# Altium project RK3128_BETA_V03_20151231.PrjPcb (part 3 of 3)
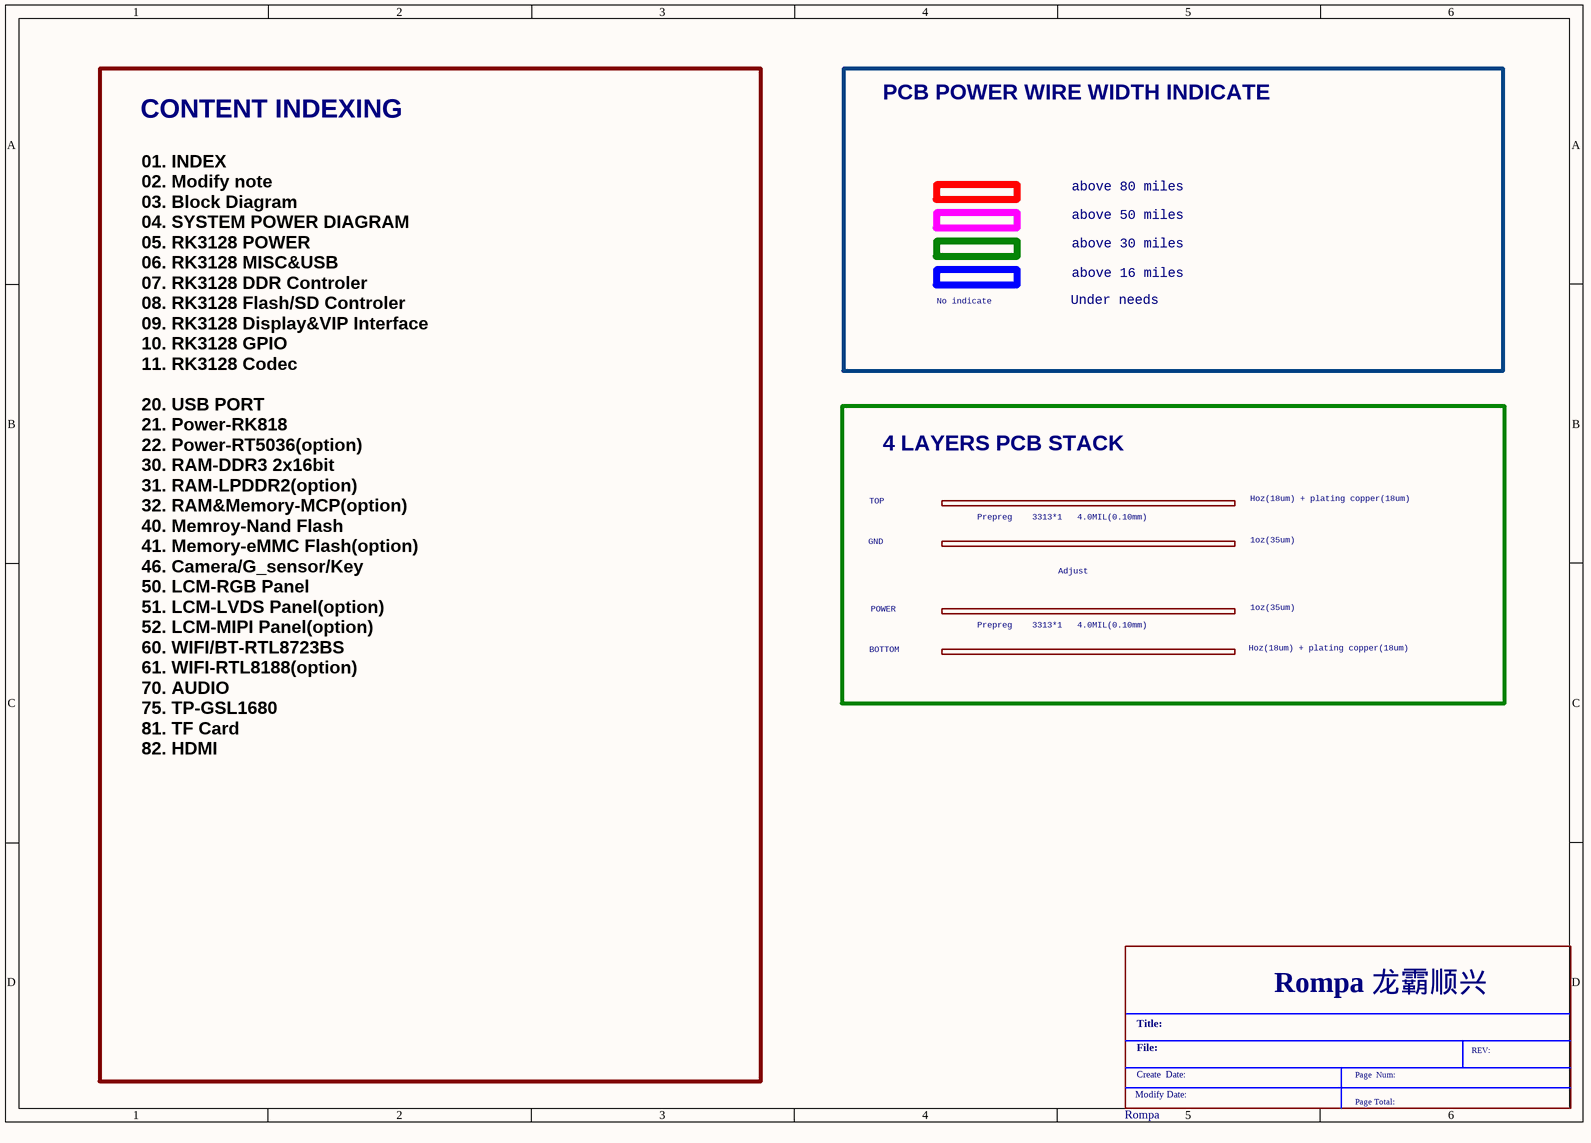
[diagram p28: 01_index.SchDoc]

## Nets that join several sheets
GND: Option_DDR3_96ball (76 pins), Option_Nand_Flash (13 pins), Option_LPDDR2-32_168_BGA134 (57 pins), Option_lcd (18 pins), Option_PMIC_RK816 (C227.2 C228.2), Option_CTP (6 pins), Option_camera (14 pins), Option_Audio (12 pins), Option_key (9 pins), Option_AP6xxx (30 pins), Option_PMIC_RK808 (65 pins), Option_Charger (25 pins), Option_LighterSensor (C149.2 C150.2 R95.1 U12.2), Option_Humidity_Tempture_Sensor (6 pins), Option_MotionSensor (11 pins), Option_PMIC_RK818 (55 pins), 11_RK3128_CODEC_HDMI_DAC (15 pins), 09_Rk3128_lcd_cif (C42.2 C43.2 C44.2 R4.2), 08_RK3128_Flash_SDMMC (P1.3), 07_RK3128_DDR (12 pins), 06_RK3128_USB_ADC_Crystal (14 pins), 05_RK3128_VDD (74 pins)
MICBIAS: Option_Audio (R37.1), 11_RK3128_CODEC_HDMI_DAC (C45.1 U1.B18)
VCC18_CIF: Option_camera (C85.1 C86.1 P3.10), Option_PMIC_RK808 (C196.1 U18.5), Option_PMIC_RK818 (C251.1 U19.51)
VCC28_CIF: Option_camera (6 pins), Option_PMIC_RK808 (C202.2 U18.14), Option_PMIC_RK818 (C249.1 U19.48)
VCC33_HDMI: Option_PMIC_RK818 (C247.1 U19.46), 11_RK3128_CODEC_HDMI_DAC (C48.1 C49.1 U1.V2)
VCC50_HDMI: Option_PMIC_RK818 (C261.1 U19.3), 11_RK3128_CODEC_HDMI_DAC (C52.2)
VCC_DDR: Option_DDR3_96ball (62 pins), Option_LPDDR2-32_168_BGA134 (40 pins), Option_PMIC_RK808 (C210.1 L12.2 R107.1), Option_PMIC_RK818 (C238.1 C239.1 L17.2 R131.1), 07_RK3128_DDR (20 pins)
VCC_IO: Option_Nand_Flash (16 pins), Option_LPDDR2-32_168_BGA134 (C170.1 R101.1 U14.1), Option_lcd (R83.1), Option_PMIC_RK816 (C226.1 L14.1 R126.1), Option_key (R78.1 R81.2 R82.2), Option_AP6xxx (L4.1 R25.2), Option_PMIC_RK808 (23 pins), Option_LighterSensor (C149.1 C150.1 U12.1), Option_Humidity_Tempture_Sensor (C142.1 R75.2 R77.2 U10.5), Option_MotionSensor (9 pins), Option_PMIC_RK818 (15 pins), 10_RK3128_misc (R13.1 R14.1), 09_Rk3128_lcd_cif (C43.1 R5.2), 06_RK3128_USB_ADC_Crystal (6 pins), 05_RK3128_VDD (8 pins)
VCC_LCD: Option_lcd (P8.4 R90.1 R91.1 R93.1), Option_PMIC_RK816 (C227.1 C228.1), Option_PMIC_RK808 (C211.2 U18.11), Option_PMIC_RK818 (C254.1 C259.1 C260.1 U19.54)
VCC_SD: Option_PMIC_RK808 (C198.2 U18.7), Option_PMIC_RK818 (C253.1 U19.52)
VCC_SYS: Option_lcd (C146.1 L9.1 U11.6), Option_Audio (C76.1 L5.1), Option_AP6xxx (L3.1), Option_PMIC_RK808 (23 pins), Option_PMIC_RK818 (20 pins)
VCC_TP: Option_CTP (C108.1 C109.1 U7.1 U7.7), Option_PMIC_RK808 (C190.2 U18.31), Option_PMIC_RK818 (C241.1 U19.14)
VCCA_CODEC: Option_PMIC_RK808 (C191.2 U18.33), Option_PMIC_RK818 (C243.1 U19.16), 11_RK3128_CODEC_HDMI_DAC (5 pins)
VDD11_HDMI: Option_PMIC_RK818 (C250.1 U19.49), 11_RK3128_CODEC_HDMI_DAC (C50.1 C51.1 U1.V4)
VDD_1.8: Option_PMIC_RK818 (C246.1 U19.44), 09_Rk3128_lcd_cif (R6.2)
VDD_11: Option_PMIC_RK808 (C194.2 U18.3), Option_PMIC_RK818 (C244.1 U19.47), 09_Rk3128_lcd_cif (C42.1 U1.R8), 06_RK3128_USB_ADC_Crystal (5 pins)
VDD_ARM: Option_PMIC_RK808 (C195.1 L10.2 U18.39), Option_PMIC_RK818 (6 pins), 05_RK3128_VDD (13 pins)
VDD_LOG: Option_PMIC_RK808 (C203.1 L11.2 U18.29), Option_PMIC_RK818 (6 pins), 05_RK3128_VDD (14 pins)
VREF_DDR: Option_DDR3_96ball (12 pins), Option_LPDDR2-32_168_BGA134 (8 pins)
ADCIN0: Option_Humidity_Tempture_Sensor (C143.1 R76.1 R77.1), 06_RK3128_USB_ADC_Crystal (U1.P11)
ADCIN1: Option_key (C144.1 R78.2 R79.1), 06_RK3128_USB_ADC_Crystal (U1.U10)
ADCIN2: Option_Humidity_Tempture_Sensor (C141.1 P7.1 R75.1), 06_RK3128_USB_ADC_Crystal (U1.V10)
BT_PCM_CLK: Option_AP6xxx (U2.26), 10_RK3128_misc (U1.K20)
BT_PCM_IN: Option_AP6xxx (U2.27), 10_RK3128_misc (U1.L20)
BT_PCM_OUT: Option_AP6xxx (U2.25), 10_RK3128_misc (U1.K19)
BT_PCM_SYNC: Option_AP6xxx (U2.28), 10_RK3128_misc (U1.J19)
Camera_I2C_SCL: Option_CTP (U7.11 U7.12), Option_camera (P3.3 P3.5), Option_LighterSensor (U12.5 U12.6), Option_Humidity_Tempture_Sensor (U10.1 U10.6), Option_MotionSensor (U15.6 U15.7 U16.2 U16.12), 10_RK3128_misc (R13.2 R14.2), 09_Rk3128_lcd_cif (U1.P3 U1.T4)
CIF_CLKI: Option_camera (R50.1), 09_Rk3128_lcd_cif (U1.U16)
CIF_CLKO: Option_camera (C88.1 R51.1), 09_Rk3128_lcd_cif (U1.V13)
CIF_D0: Option_camera (P3.19), 09_Rk3128_lcd_cif (U1.U17)
CIF_D1: Option_camera (P3.21), 09_Rk3128_lcd_cif (U1.V17)
CIF_D2: Option_camera (P3.22), 09_Rk3128_lcd_cif (U1.W17)
CIF_D3: Option_camera (P3.20), 09_Rk3128_lcd_cif (U1.V16)
CIF_D4: Option_camera (P3.18), 09_Rk3128_lcd_cif (U1.T13)
CIF_D5: Option_camera (P3.16), 09_Rk3128_lcd_cif (U1.R13)
CIF_D6: Option_camera (P3.14), 09_Rk3128_lcd_cif (U1.R14)
CIF_D7: Option_camera (P3.12), 09_Rk3128_lcd_cif (U1.T16)
CIF_HREF: Option_camera (P3.9), 09_Rk3128_lcd_cif (U1.V18)
CIF_VSYNC: Option_camera (P3.7), 09_Rk3128_lcd_cif (U1.U13)
CODEC_AOL: Option_Audio (C81.1), 11_RK3128_CODEC_HDMI_DAC (U1.B17)
CODEC_AOR: Option_Audio (C80.1), 11_RK3128_CODEC_HDMI_DAC (U1.B15)
DDR_A0: Option_DDR3_96ball (U8.N3 U9.N3), Option_LPDDR2-32_168_BGA134 (U13.AC6), 07_RK3128_DDR (U1.D1)
DDR_A1: Option_DDR3_96ball (U8.P7 U9.P7), Option_LPDDR2-32_168_BGA134 (U13.AB6), 07_RK3128_DDR (U1.A4)
DDR_A2: Option_DDR3_96ball (U8.P3 U9.P3), Option_LPDDR2-32_168_BGA134 (U13.AC7), 07_RK3128_DDR (U1.E2)
DDR_A3: Option_DDR3_96ball (U8.N2 U9.N2), Option_LPDDR2-32_168_BGA134 (U13.AB8), 07_RK3128_DDR (U1.D2)
DDR_A4: Option_DDR3_96ball (U8.P8 U9.P8), Option_LPDDR2-32_168_BGA134 (U13.AB9), 07_RK3128_DDR (U1.A2)
DDR_A5: Option_DDR3_96ball (U8.P2 U9.P2), Option_LPDDR2-32_168_BGA134 (U13.W1), 07_RK3128_DDR (U1.E5)
DDR_A6: Option_DDR3_96ball (U8.R8 U9.R8), Option_LPDDR2-32_168_BGA134 (U13.V2), 07_RK3128_DDR (U1.F7)
DDR_A7: Option_DDR3_96ball (U8.R2 U9.R2), Option_LPDDR2-32_168_BGA134 (U13.U1), 07_RK3128_DDR (U1.E4)
DDR_A8: Option_DDR3_96ball (U8.T8 U9.T8), Option_LPDDR2-32_168_BGA134 (U13.T2), 07_RK3128_DDR (U1.D8)
DDR_A9: Option_DDR3_96ball (U8.R3 U9.R3), Option_LPDDR2-32_168_BGA134 (U13.T1), 07_RK3128_DDR (U1.E1)
DDR_A10: Option_DDR3_96ball (U8.L7 U9.L7), 07_RK3128_DDR (U1.C4)
DDR_A11: Option_DDR3_96ball (U8.R7 U9.R7), 07_RK3128_DDR (U1.C5)
DDR_A12: Option_DDR3_96ball (U8.N7 U9.N7), 07_RK3128_DDR (U1.B4)
DDR_A13: Option_DDR3_96ball (U8.T3 U9.T3), 07_RK3128_DDR (U1.G1)
DDR_A14: Option_DDR3_96ball (U8.T7 U9.T7), 07_RK3128_DDR (U1.B5)
DDR_A15: Option_DDR3_96ball (U8.M7 U9.M7), 07_RK3128_DDR (U1.A5)
DDR_BA0: Option_DDR3_96ball (U8.M2 U9.M2), 07_RK3128_DDR (U1.D7)
DDR_BA1: Option_DDR3_96ball (U8.N8 U9.N8), 07_RK3128_DDR (U1.E8)
DDR_BA2: Option_DDR3_96ball (U8.M3 U9.M3), 07_RK3128_DDR (U1.D3)
DDR_CASN: Option_DDR3_96ball (U8.K3 U9.K3), 07_RK3128_DDR (U1.E7)
DDR_CKE: Option_LPDDR2-32_168_BGA134 (U13.AC3 U13.AC4), 07_RK3128_DDR (U1.B3)
DDR_CLK: Option_DDR3_96ball (R72.1 U8.J7 U9.J7), Option_LPDDR2-32_168_BGA134 (R98.2 U13.Y2), 07_RK3128_DDR (U1.B1)
DDR_CLKN: Option_DDR3_96ball (R72.2 U8.K7 U9.K7), Option_LPDDR2-32_168_BGA134 (R98.1 U13.Y1), 07_RK3128_DDR (U1.C2)
DDR_CS0N: Option_DDR3_96ball (U8.L2 U9.L2), Option_LPDDR2-32_168_BGA134 (U13.AB3), 07_RK3128_DDR (U1.A1)
DDR_CS1N: Option_DDR3_96ball (U8.L1 U9.L1), Option_LPDDR2-32_168_BGA134 (U13.AB4), 07_RK3128_DDR (U1.B6)
DDR_D0: Option_DDR3_96ball (U9.F2), Option_LPDDR2-32_168_BGA134 (U13.AA23), 07_RK3128_DDR (U1.A14)
DDR_D1: Option_DDR3_96ball (U9.H8), Option_LPDDR2-32_168_BGA134 (U13.Y22), 07_RK3128_DDR (U1.F8)
DDR_D2: Option_DDR3_96ball (U9.H7), Option_LPDDR2-32_168_BGA134 (U13.W22), 07_RK3128_DDR (U1.F11)
DDR_D3: Option_DDR3_96ball (U9.F8), Option_LPDDR2-32_168_BGA134 (U13.W23), 07_RK3128_DDR (U1.A7)
DDR_D4: Option_DDR3_96ball (U9.F7), Option_LPDDR2-32_168_BGA134 (U13.V23), 07_RK3128_DDR (U1.B10)
DDR_D5: Option_DDR3_96ball (U9.H3), Option_LPDDR2-32_168_BGA134 (U13.U22), 07_RK3128_DDR (U1.D10)
DDR_D6: Option_DDR3_96ball (U9.E3), Option_LPDDR2-32_168_BGA134 (U13.T22), 07_RK3128_DDR (U1.B13)
DDR_D7: Option_DDR3_96ball (U9.G2), Option_LPDDR2-32_168_BGA134 (U13.T23), 07_RK3128_DDR (U1.C8)
DDR_D8: Option_DDR3_96ball (U8.H7), Option_LPDDR2-32_168_BGA134 (U13.H22), 07_RK3128_DDR (U1.G6)
DDR_D9: Option_DDR3_96ball (U8.F8), Option_LPDDR2-32_168_BGA134 (U13.H23), 07_RK3128_DDR (U1.G5)
DDR_D10: Option_DDR3_96ball (U8.H8), Option_LPDDR2-32_168_BGA134 (U13.G23), 07_RK3128_DDR (U1.F2)
DDR_D11: Option_DDR3_96ball (U8.E3), Option_LPDDR2-32_168_BGA134 (U13.F22), 07_RK3128_DDR (U1.H6)
DDR_D12: Option_DDR3_96ball (U8.H3), Option_LPDDR2-32_168_BGA134 (U13.E22), 07_RK3128_DDR (U1.H3)
DDR_D13: Option_DDR3_96ball (U8.F7), Option_LPDDR2-32_168_BGA134 (U13.E23), 07_RK3128_DDR (U1.J2)
DDR_D14: Option_DDR3_96ball (U8.G2), Option_LPDDR2-32_168_BGA134 (U13.D23), 07_RK3128_DDR (U1.K2)
DDR_D15: Option_DDR3_96ball (U8.F2), Option_LPDDR2-32_168_BGA134 (U13.C22), 07_RK3128_DDR (U1.K1)
DDR_D16: Option_DDR3_96ball (U9.D7), Option_LPDDR2-32_168_BGA134 (U13.AB12), 07_RK3128_DDR (U1.A10)
DDR_D17: Option_DDR3_96ball (U9.A7), Option_LPDDR2-32_168_BGA134 (U13.AC13), 07_RK3128_DDR (U1.C11)
DDR_D18: Option_DDR3_96ball (U9.B8), Option_LPDDR2-32_168_BGA134 (U13.AB14), 07_RK3128_DDR (U1.B9)
DDR_D19: Option_DDR3_96ball (U9.A2), Option_LPDDR2-32_168_BGA134 (U13.AC14), 07_RK3128_DDR (U1.E11)
DDR_D20: Option_DDR3_96ball (U9.C3), Option_LPDDR2-32_168_BGA134 (U13.AB15), 07_RK3128_DDR (U1.E10)
DDR_D21: Option_DDR3_96ball (U9.C8), Option_LPDDR2-32_168_BGA134 (U13.AC16), 07_RK3128_DDR (U1.B12)
DDR_D22: Option_DDR3_96ball (U9.C2), Option_LPDDR2-32_168_BGA134 (U13.AB17), 07_RK3128_DDR (U1.F10)
DDR_D23: Option_DDR3_96ball (U9.A3), Option_LPDDR2-32_168_BGA134 (U13.AC17), 07_RK3128_DDR (U1.A13)
DDR_D24: Option_DDR3_96ball (U8.D7), Option_LPDDR2-32_168_BGA134 (U13.B17), 07_RK3128_DDR (U1.K4)
DDR_D25: Option_DDR3_96ball (U8.C3), Option_LPDDR2-32_168_BGA134 (U13.A17), 07_RK3128_DDR (U1.L4)
DDR_D26: Option_DDR3_96ball (U8.C8), Option_LPDDR2-32_168_BGA134 (U13.A16), 07_RK3128_DDR (U1.G4)
DDR_D27: Option_DDR3_96ball (U8.A2), Option_LPDDR2-32_168_BGA134 (U13.B15), 07_RK3128_DDR (U1.K5)
DDR_D28: Option_DDR3_96ball (U8.A7), Option_LPDDR2-32_168_BGA134 (U13.B14), 07_RK3128_DDR (U1.H5)
DDR_D29: Option_DDR3_96ball (U8.A3), Option_LPDDR2-32_168_BGA134 (U13.A14), 07_RK3128_DDR (U1.K6)
DDR_D30: Option_DDR3_96ball (U8.B8), Option_LPDDR2-32_168_BGA134 (U13.A13), 07_RK3128_DDR (U1.L5)
DDR_D31: Option_DDR3_96ball (U8.C2), Option_LPDDR2-32_168_BGA134 (U13.B12), 07_RK3128_DDR (U1.L6)
DDR_DM0: Option_DDR3_96ball (U9.E7), Option_LPDDR2-32_168_BGA134 (U13.N23), 07_RK3128_DDR (U1.B7)
DDR_DM1: Option_DDR3_96ball (U8.E7), Option_LPDDR2-32_168_BGA134 (U13.L23), 07_RK3128_DDR (U1.H4)
DDR_DM2: Option_DDR3_96ball (U9.D3), Option_LPDDR2-32_168_BGA134 (U13.AB20), 07_RK3128_DDR (U1.D11)
DDR_DM3: Option_DDR3_96ball (U8.D3), Option_LPDDR2-32_168_BGA134 (U13.B20), 07_RK3128_DDR (U1.L3)
DDR_DQS0N: Option_DDR3_96ball (U9.G3), Option_LPDDR2-32_168_BGA134 (U13.P22), 07_RK3128_DDR (U1.B8)
DDR_DQS0P: Option_DDR3_96ball (U9.F3), Option_LPDDR2-32_168_BGA134 (U13.R23), 07_RK3128_DDR (U1.A8)
DDR_DQS1N: Option_DDR3_96ball (U8.G3), Option_LPDDR2-32_168_BGA134 (U13.K23), 07_RK3128_DDR (U1.H2)
DDR_DQS1P: Option_DDR3_96ball (U8.F3), Option_LPDDR2-32_168_BGA134 (U13.J22), 07_RK3128_DDR (U1.H1)
DDR_DQS2N: Option_DDR3_96ball (U9.B7), Option_LPDDR2-32_168_BGA134 (U13.AC19), 07_RK3128_DDR (U1.B11)
DDR_DQS2P: Option_DDR3_96ball (U9.C7), Option_LPDDR2-32_168_BGA134 (U13.AB18), 07_RK3128_DDR (U1.A11)
DDR_DQS3N: Option_DDR3_96ball (U8.B7), Option_LPDDR2-32_168_BGA134 (U13.A19), 07_RK3128_DDR (U1.L2)
DDR_DQS3P: Option_DDR3_96ball (U8.C7), Option_LPDDR2-32_168_BGA134 (U13.B18), 07_RK3128_DDR (U1.L1)
DDR_ODT0: Option_DDR3_96ball (U8.K1 U9.K1), 07_RK3128_DDR (U1.B2)
DDR_ODT1: Option_DDR3_96ball (U8.J1 U9.J1), 07_RK3128_DDR (U1.G2)
DDR_RASN: Option_DDR3_96ball (U8.J3 U9.J3), 07_RK3128_DDR (U1.E3)
DDR_RST: Option_DDR3_96ball (U8.T2 U9.T2), 07_RK3128_DDR (U1.F6)
DDR_WEN: Option_DDR3_96ball (U8.L3 U9.L3), 07_RK3128_DDR (U1.D5)
FLASH_ALE: Option_Nand_Flash (U17.17), 08_RK3128_Flash_SDMMC (U1.N16)
FLASH_CLE: Option_Nand_Flash (J1.1 U17.16), 08_RK3128_Flash_SDMMC (U1.N17)
FLASH_CS0: Option_Nand_Flash (U17.9), 08_RK3128_Flash_SDMMC (U1.L16)
FLASH_CS1: Option_Nand_Flash (U17.10), 08_RK3128_Flash_SDMMC (U1.L17)
FLASH_D0: Option_Nand_Flash (U17.29), 08_RK3128_Flash_SDMMC (U1.P16)
FLASH_D1: Option_Nand_Flash (U17.30), 08_RK3128_Flash_SDMMC (U1.U20)
FLASH_D2: Option_Nand_Flash (U17.31), 08_RK3128_Flash_SDMMC (U1.T19)
FLASH_D3: Option_Nand_Flash (U17.32), 08_RK3128_Flash_SDMMC (U1.T20)
FLASH_D4: Option_Nand_Flash (U17.41), 08_RK3128_Flash_SDMMC (U1.P18)
FLASH_D5: Option_Nand_Flash (U17.42), 08_RK3128_Flash_SDMMC (U1.R19)
FLASH_D6: Option_Nand_Flash (U17.43), 08_RK3128_Flash_SDMMC (U1.N15)
FLASH_D7: Option_Nand_Flash (U17.44), 08_RK3128_Flash_SDMMC (U1.P17)
FLASH_RDN: Option_Nand_Flash (U17.8), 08_RK3128_Flash_SDMMC (U1.L15)
FLASH_RDY: Option_Nand_Flash (5 pins), 08_RK3128_Flash_SDMMC (U1.K17)
FLASH_WRN: Option_Nand_Flash (U17.18), 08_RK3128_Flash_SDMMC (U1.P20)
GPIO0_B4/I2S_LRCK_TX: Option_PMIC_RK816 (R127.2), Option_PMIC_RK818 (R135.2), 10_RK3128_misc (U1.H16)
GPIO0_D3/BL_EN: Option_lcd (R85.1 U11.4), 10_RK3128_misc (U1.T17)
GPIO1_A7: Option_AP6xxx (R18.1), 08_RK3128_Flash_SDMMC (U1.L19)
GPIO1_B6/DVSOK: Option_PMIC_RK808 (R110.1 U18.54), 08_RK3128_Flash_SDMMC (U1.N18)
GPIO3_B3/CIF_PDN1: Option_camera (P3.1), 09_Rk3128_lcd_cif (U1.Y20)
GPIO3_C4/CIF_RESET: Option_camera (R49.1), 10_RK3128_misc (U1.D19)
GPIO3_C5/BT_RST: Option_AP6xxx (U2.34), 10_RK3128_misc (U1.F13)
GPIO3_C6/BT_HOST_WAKE: Option_AP6xxx (U2.7), 10_RK3128_misc (U1.C18)
GPIO3_D3/SPDIF: Option_LighterSensor (U12.4), 10_RK3128_misc (U1.Y19)
GPIO3_D7/CIF_PDN0: Option_camera (P3.8), 09_Rk3128_lcd_cif (U1.K18)
HDMI_CEC/WORKLED: Option_key (D11.2), 11_RK3128_CODEC_HDMI_DAC (U1.C19)
HDMI_DSCK/CHARGERLED: Option_key (D12.2), 11_RK3128_CODEC_HDMI_DAC (U1.B20)
HDMI_DSDA/CHARGERCTL: Option_PMIC_RK808 (P9.2 R109.1), 11_RK3128_CODEC_HDMI_DAC (U1.F14)
HSYNC: Option_lcd (P8.32 R90.2), 09_Rk3128_lcd_cif (C44.1 R11.2)
I2C0_SCL: Option_PMIC_RK808 (R106.2 U18.19), Option_PMIC_RK818 (R142.2 U19.35), 10_RK3128_misc (U1.D20)
I2C0_SDA: Option_PMIC_RK808 (R105.2 U18.18), Option_PMIC_RK818 (R141.2 U19.36), 10_RK3128_misc (U1.E17)
LCD_CLK/MAC_RXDV: Option_lcd (R92.1), 09_Rk3128_lcd_cif (U1.U5)
LCD_CTP_XL: Option_lcd (P8.39), Option_CTP (U7.2)
LCD_CTP_XR: Option_lcd (P8.37), Option_CTP (U7.4)
LCD_CTP_YD: Option_lcd (P8.38), Option_CTP (U7.5)
LCD_CTP_YU: Option_lcd (P8.40), Option_CTP (U7.3)
LCD_D0/MIPI_D0P: Option_lcd (P8.23), 09_Rk3128_lcd_cif (U1.Y13)
LCD_D1/MIPI_D0N: Option_lcd (P8.24), 09_Rk3128_lcd_cif (U1.W13)
LCD_D2/MIPI_D1P: Option_lcd (P8.25), 09_Rk3128_lcd_cif (U1.Y11)
LCD_D3/MIPI_D1N: Option_lcd (P8.26), 09_Rk3128_lcd_cif (U1.W11)
LCD_D4/MIPI_D2P: Option_lcd (P8.27), 09_Rk3128_lcd_cif (U1.Y10)
LCD_D5/MIPI_D2N: Option_lcd (P8.28), 09_Rk3128_lcd_cif (U1.W10)
LCD_D6/MIPI_D3P: Option_lcd (P8.15), 09_Rk3128_lcd_cif (U1.W8)
LCD_D7/MIPI_D3N: Option_lcd (P8.16), 09_Rk3128_lcd_cif (U1.Y8)
LCD_D8/MIPI_CLKP: Option_lcd (P8.17), 09_Rk3128_lcd_cif (U1.Y7)
LCD_D9/MIPI-CLKN: Option_lcd (P8.18), 09_Rk3128_lcd_cif (U1.W7)
LCD_D10/MAC_MDIO: Option_lcd (P8.19), 09_Rk3128_lcd_cif (U1.U3)
LCD_D11/MAC_TXEN: Option_lcd (P8.20), 09_Rk3128_lcd_cif (R12.2)
LCD_D12/MAC_CLK: Option_lcd (P8.7), 09_Rk3128_lcd_cif (U1.U4)
LCD_D13/MAC_RXER: Option_lcd (P8.8), 09_Rk3128_lcd_cif (U1.T1)
LCD_D14/MAC_RXD1: Option_lcd (P8.9), 09_Rk3128_lcd_cif (U1.T3)
LCD_D15/MAC_RXD0: Option_lcd (P8.10), 09_Rk3128_lcd_cif (U1.R2)
LCD_D16/MAC_TXD1: Option_lcd (P8.11), 09_Rk3128_lcd_cif (R8.2)
LCD_D17/MAC_TXD0: Option_lcd (P8.12), 09_Rk3128_lcd_cif (R7.2)
LCD_DEN/MAC_RXCLK: Option_lcd (P8.34), 09_Rk3128_lcd_cif (U1.U1)
LCDC_BL: Option_lcd (R83.2 R89.1), 10_RK3128_misc (U1.U18)
MICIN-N: Option_Audio (C75.1), 11_RK3128_CODEC_HDMI_DAC (U1.E14)
MICIN-P: Option_Audio (C73.1), 11_RK3128_CODEC_HDMI_DAC (U1.E16)
PMIC_INT: Option_PMIC_RK808 (R111.1 U18.49), Option_PMIC_RK818 (U19.1), 10_RK3128_misc (U1.H18)
PMIC_SLEEP: Option_PMIC_RK808 (U18.50), Option_PMIC_RK818 (U19.2), 10_RK3128_misc (U1.U14)
PWR_KEY: Option_PMIC_RK808 (R121.2), 10_RK3128_misc (U1.F19)
RESET: Option_PMIC_RK808 (R119.1 R120.2 R122.1 U18.20), Option_PMIC_RK818 (R138.2 U19.34), 06_RK3128_USB_ADC_Crystal (C21.1 U1.N20)
RTC_CLKOUT: Option_AP6xxx (R25.1 R26.1), Option_PMIC_RK808 (U18.68), Option_PMIC_RK818 (U19.31 U19.32)
SDMMC1_CLK: Option_AP6xxx (R20.1), 10_RK3128_misc (U1.E20)
SDMMC1_CMD: Option_AP6xxx (R19.1), 10_RK3128_misc (U1.D17)
SDMMC1_D0: Option_AP6xxx (R24.1), 10_RK3128_misc (U1.E18)
SDMMC1_D1: Option_AP6xxx (R21.1), 10_RK3128_misc (U1.E19)
SDMMC1_D2: Option_AP6xxx (R23.1), 10_RK3128_misc (U1.G16)
SDMMC1_D3: Option_AP6xxx (R22.1), 10_RK3128_misc (U1.G17)
SDMMC_D2/DVS1: Option_PMIC_RK808 (U18.22), 08_RK3128_Flash_SDMMC (U1.K16)
SDMMC_D3/DVS2: Option_PMIC_RK808 (U18.21), 08_RK3128_Flash_SDMMC (U1.M19)
SDMMC_DET: Option_AP6xxx (R17.1), 08_RK3128_Flash_SDMMC (U1.W19)
SPK_CTL: Option_Audio (R43.1), 10_RK3128_misc (U1.A20)
TP_INT: Option_CTP (U7.10), 10_RK3128_misc (U1.G19)
UART0_CTS: Option_AP6xxx (U2.41), 10_RK3128_misc (U1.W20)
UART0_RTS: Option_AP6xxx (U2.44), 10_RK3128_misc (U1.P15)
UART0_RXD: Option_AP6xxx (R36.1 U2.42), 10_RK3128_misc (U1.Y17)
UART0_TXD: Option_AP6xxx (R35.1 U2.43), 10_RK3128_misc (U1.T18)
VCCIO_WL: Option_PMIC_RK816 (L14.2), Option_AP6xxx (13 pins), Option_PMIC_RK808 (C208.2 U18.15), Option_PMIC_RK818 (L19.2)
VSYNC: Option_lcd (P8.33 R91.2), 09_Rk3128_lcd_cif (U1.V5)
WIFI_HOST_WAKE: Option_AP6xxx (U2.13), 10_RK3128_misc (U1.G20)